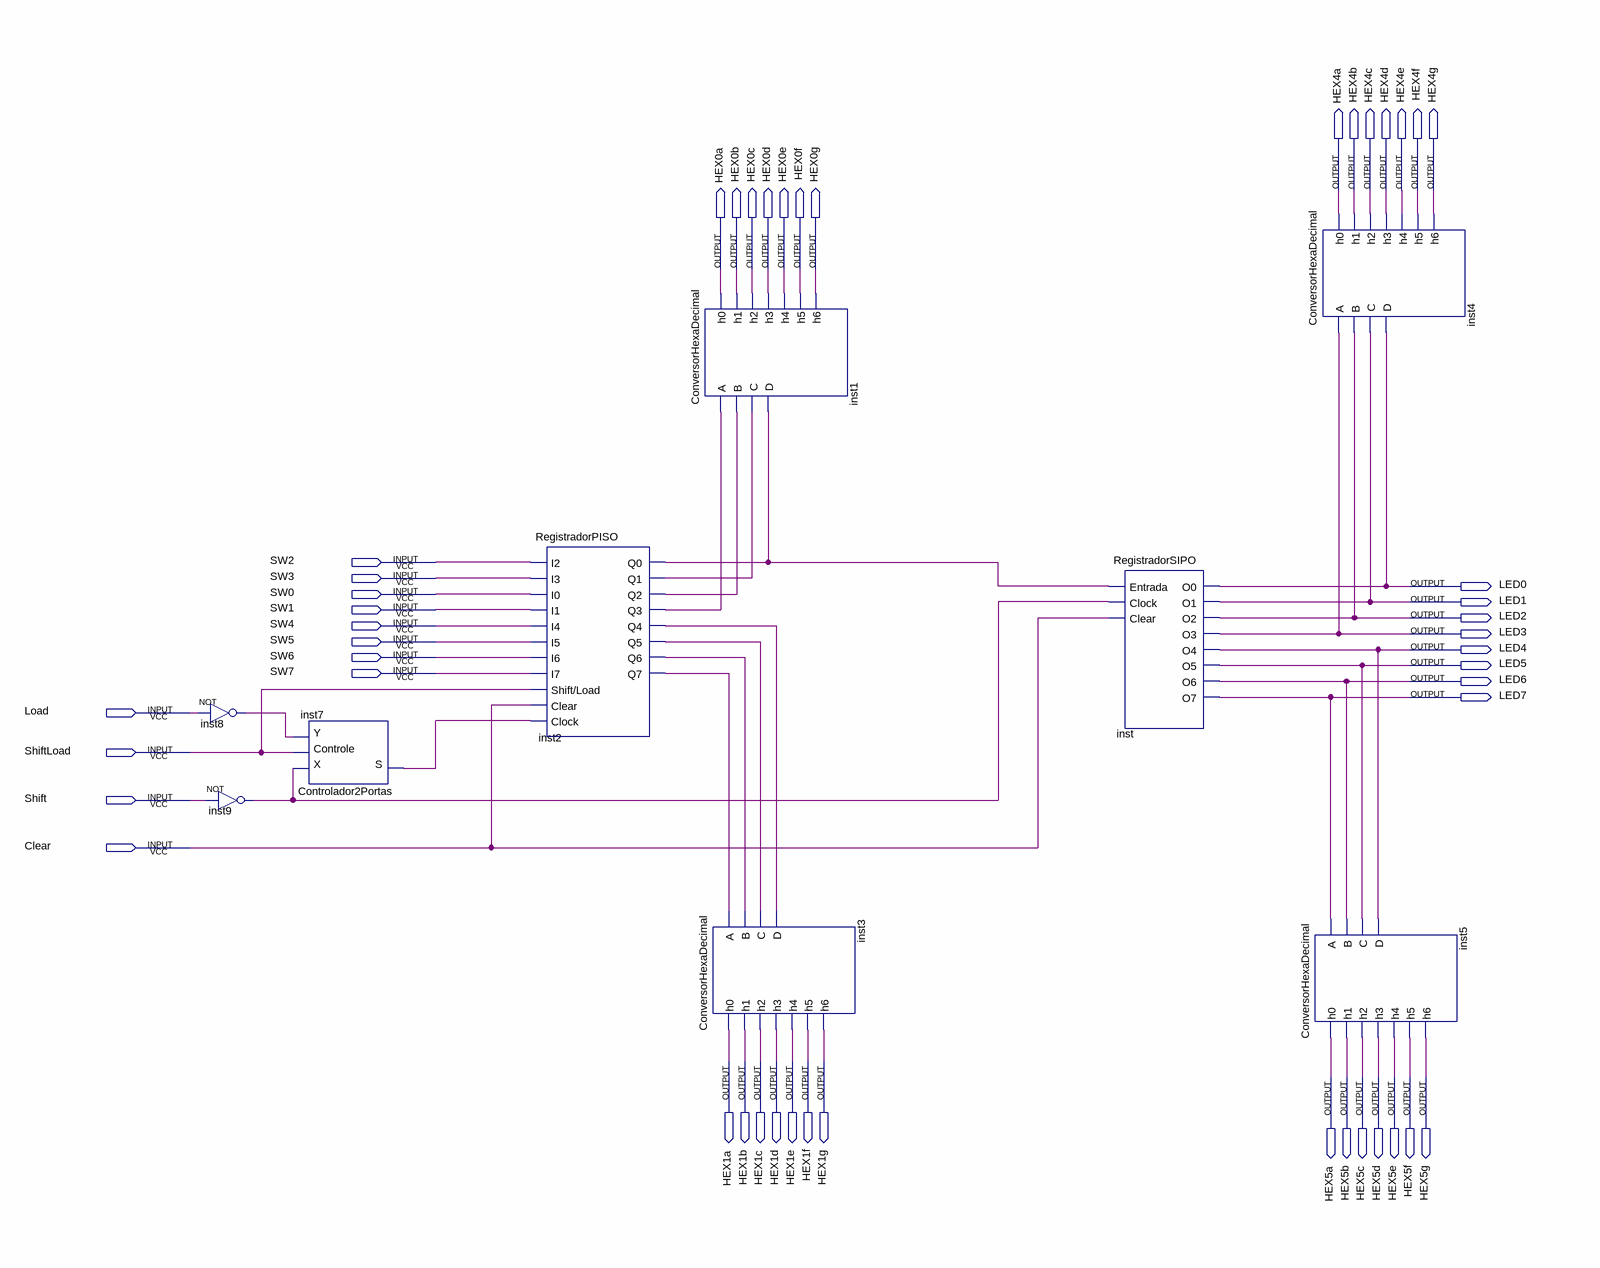
[diagram p0: schematic sheet]
// Quartus schematic LAB3.bdf as structural Verilog: 9 symbols, 48 pins
module LAB3 (
  input  SW2,
  input  SW3,
  input  SW0,
  input  SW1,
  input  SW4,
  input  SW5,
  input  SW6,
  input  SW7,
  input  Load,
  input  ShiftLoad,
  input  Shift,
  input  Clear,
  output HEX4a,
  output HEX4b,
  output HEX4c,
  output HEX4d,
  output HEX4e,
  output HEX4f,
  output HEX4g,
  output HEX0a,
  output HEX0b,
  output HEX0c,
  output HEX0d,
  output HEX0e,
  output HEX0f,
  output HEX0g,
  output LED0,
  output LED1,
  output LED2,
  output LED3,
  output LED4,
  output LED5,
  output LED6,
  output LED7,
  output HEX1a,
  output HEX1b,
  output HEX1c,
  output HEX1d,
  output HEX1e,
  output HEX1f,
  output HEX1g,
  output HEX5a,
  output HEX5b,
  output HEX5c,
  output HEX5d,
  output HEX5e,
  output HEX5f,
  output HEX5g
);

  wire inst2_q0, inst2_q1, inst2_q2, inst2_q3, inst2_q4, inst2_q5, inst2_q6, inst2_q7, inst7_s, inst8_out,
       inst9_out;

  not inst8 (inst8_out, Load);
  not inst9 (inst9_out, Shift);
  Controlador2Portas inst7 (.X(inst9_out), .Controle(ShiftLoad), .Y(inst8_out), .S(inst7_s));
  RegistradorPISO inst2 (
    .I2(SW2), .I3(SW3), .I0(SW0), .I1(SW1), .I4(SW4), .I5(SW5), .I6(SW6), .I7(SW7), .\Shift/Load (ShiftLoad),
    .Clear(Clear), .Clock(inst7_s), .Q0(inst2_q0), .Q1(inst2_q1), .Q2(inst2_q2), .Q3(inst2_q3),
    .Q4(inst2_q4), .Q5(inst2_q5), .Q6(inst2_q6), .Q7(inst2_q7));
  ConversorHexaDecimal inst1 (
    .A(inst2_q3), .B(inst2_q2), .C(inst2_q1), .D(inst2_q0), .h0(HEX0a), .h1(HEX0b), .h2(HEX0c), .h3(HEX0d),
    .h4(HEX0e), .h5(HEX0f), .h6(HEX0g));
  ConversorHexaDecimal inst3 (
    .A(inst2_q7), .B(inst2_q6), .C(inst2_q5), .D(inst2_q4), .h0(HEX1a), .h1(HEX1b), .h2(HEX1c), .h3(HEX1d),
    .h4(HEX1e), .h5(HEX1f), .h6(HEX1g));
  RegistradorSIPO inst (
    .Entrada(inst2_q0), .Clock(inst9_out), .Clear(Clear), .O0(LED0), .O1(LED1), .O2(LED2), .O3(LED3),
    .O4(LED4), .O5(LED5), .O6(LED6), .O7(LED7));
  ConversorHexaDecimal inst5 (
    .A(LED7), .B(LED6), .C(LED5), .D(LED4), .h0(HEX5a), .h1(HEX5b), .h2(HEX5c), .h3(HEX5d), .h4(HEX5e),
    .h5(HEX5f), .h6(HEX5g));
  ConversorHexaDecimal inst4 (
    .A(LED3), .B(LED2), .C(LED1), .D(LED0), .h0(HEX4a), .h1(HEX4b), .h2(HEX4c), .h3(HEX4d), .h4(HEX4e),
    .h5(HEX4f), .h6(HEX4g));
endmodule
